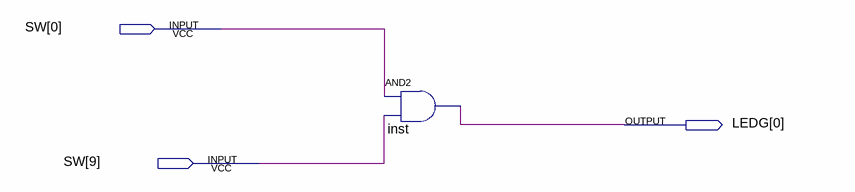
[diagram p0: schematic sheet]
// Quartus schematic Projeto2.bdf as structural Verilog: 1 symbols, 3 pins
module Projeto2 (
  input  [9:0] SW,
  output [0:0] LEDG
);

  and inst (LEDG[0], SW[0], SW[9]);
endmodule
